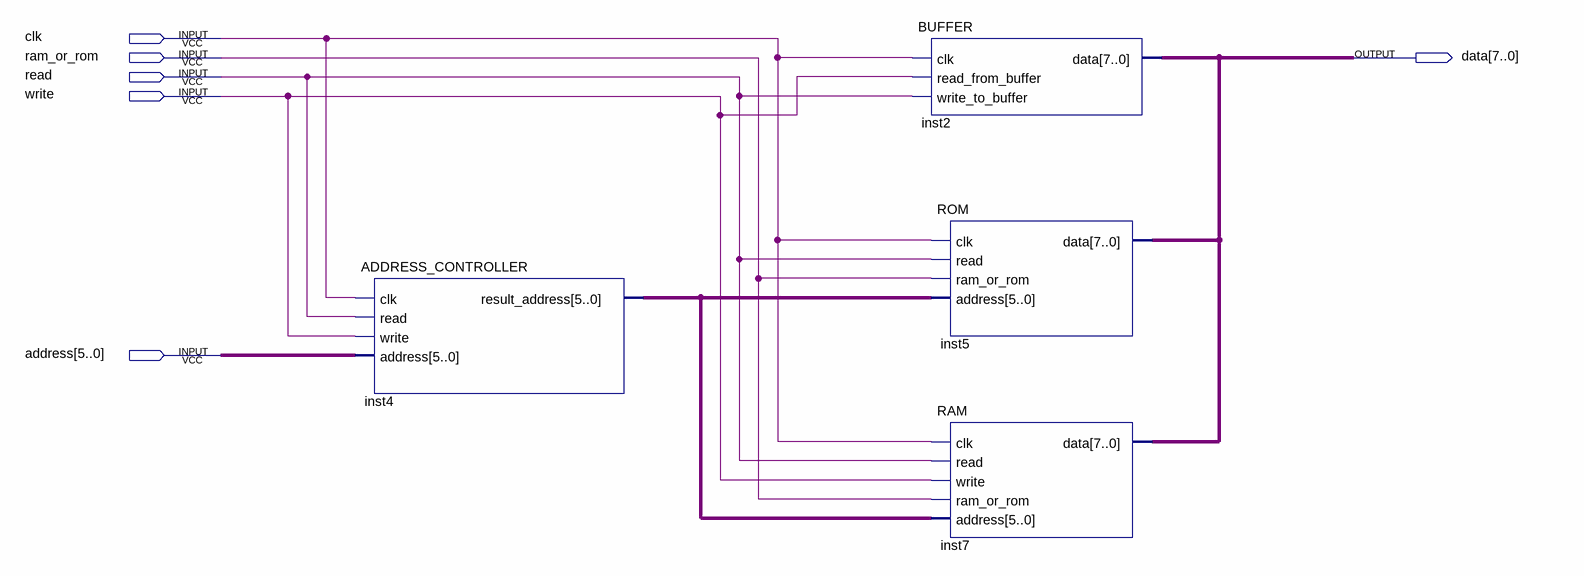
[diagram p0: schematic sheet]
// Quartus schematic MAIN.bdf as structural Verilog: 4 symbols, 6 pins
module MAIN (
  input  clk,
  input  ram_or_rom,
  input  read,
  input  write,
  input  [5:0] address,
  output [7:0] data
);

  wire [5:0] inst4_result_address;

  ADDRESS_CONTROLLER inst4 (
    .clk(clk), .read(read), .write(write), .address(address), .result_address(inst4_result_address));
  BUFFER inst2 (.clk(clk), .read_from_buffer(write), .write_to_buffer(read), .data(data));
  ROM inst5 (.clk(clk), .read(read), .ram_or_rom(ram_or_rom), .address(inst4_result_address), .data(data));
  RAM inst7 (
    .clk(clk), .read(read), .write(write), .ram_or_rom(ram_or_rom), .address(inst4_result_address),
    .data(data));
endmodule
